# Altium schematic sheet Power.SchDoc
size A
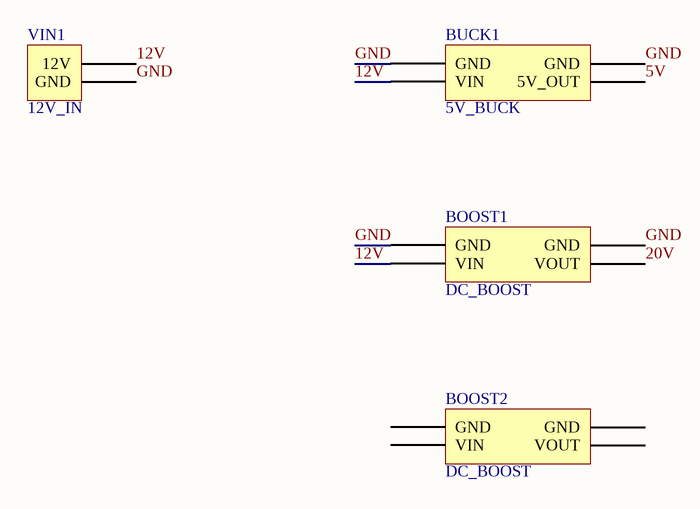
[diagram p0: Power.SchDoc]

## Parts
BOOST1  DC_BOOST
BOOST2  DC_BOOST
BUCK1  5V_BUCK
VIN1  12V_IN

## Nets
5V: BUCK1.3(5V_OUT)
12V: BOOST1.2(VIN) BUCK1.2(VIN) VIN1.2(12V)
20V: BOOST1.3(VOUT)
GND: BOOST1.1(GND) BOOST1.4(GND) BUCK1.1(GND) BUCK1.4(GND) VIN1.1(GND)

Not connected (* = marked no-connect by the designer): BOOST2 1(GND) 2(VIN) 3(VOUT) 4(GND)

## Library data of the parts
BOOST1 = DC_BOOST: Boost converter for 20V power for pressure transducers